# Altium schematic sheet Sheet1.SchDoc
size A
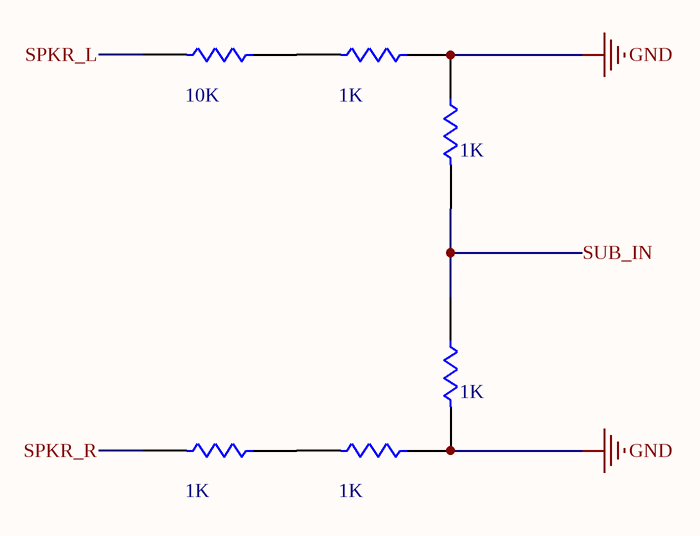
[diagram p0: Sheet1.SchDoc]

## Parts
R1  value 10K  [SOIC16_M]  (hidden comment: Res Pack1)  (parts A,B of 8)
R2  value 1K  [SOIC16_N]  (hidden comment: Res Pack1)  (part B of 8)
R3  value 1K  [SOIC16_N]  (hidden comment: Res Pack1)  (part D of 8)
R5  value 1K  [SOIC16_N]  (hidden comment: Res Pack1)  (part E of 8)
R6  value 1K  [SOIC16_N]  (hidden comment: Res Pack1)  (part F of 8)

## Nets
GND: R2.15 R3.13 R5.12 R6.6
SPKR_L: R1.1
SPKR_R: R1.2
SUB_IN: R5.5 R6.11
NetR1_15: R1.15 R3.4
NetR1_16: R1.16 R2.2

## Library data of the parts
R1-R3 R5 R6 = Res Pack1: Isolated Resistor Network - Parts; Sim Note: Enter the Resistance value into parameter field.; Published: 24-Mar-1999; LatestRevisionDate: 29-May-2009; LatestRevisionNote: IPC-7351 Footprint Added.; PackageReference: SOIC16; Publisher: Altium Limited; PackageDescription: 16-Pin Small Outline Integrated Circuit 1.27 mm Pitch; Code_JEDEC: MS-012-AC; Code_IPC: SOIC127P600-16